# Altium schematic sheet 50YXJ10M5X111_50YXJ10M5X11.schdoc
size 127 x 101 mm
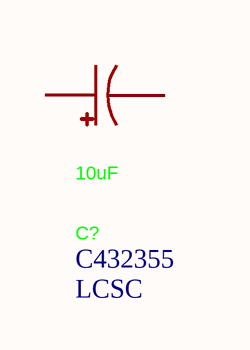
[diagram p0: 50YXJ10M5X111_50YXJ10M5X11.schdoc]

## Parts
C?  10uF  Supplier Part: C432355  Supplier: LCSC  [CAP-TH_BD5.0-P2.00-D0.8-FD]

## Nets

Not connected (* = marked no-connect by the designer): C? 1 2

## Library data of the parts
C? = 50YXJ10M5X11: Manufacturer: Rubycon(红宝石); Add into BOM: yes; Tolerance: ±20%; Voltage Rating: 50V; Pin Spacing: 2mm; Lifetime: 5000hrs@105℃; Symbol: 50YXJ10M5X11; Device: 50YXJ10M5X11; Value: 10uF; LCSC Part Name: 10uF ±20% 50V; Manufacturer Part: 50YXJ10M5X11; Supplier Footprint: 插件,D5xL11mm; JLCPCB Part Class: Extended Part; Datasheet: https://item.szlcsc.com/datasheet/50YXJ10M5X11/429163.html; Convert to PCB: yes; Diameter: 5mm; Height - Seated (Max): 11mm